# EAGLE schematic MainPSU (EAGLE 7.6.0)
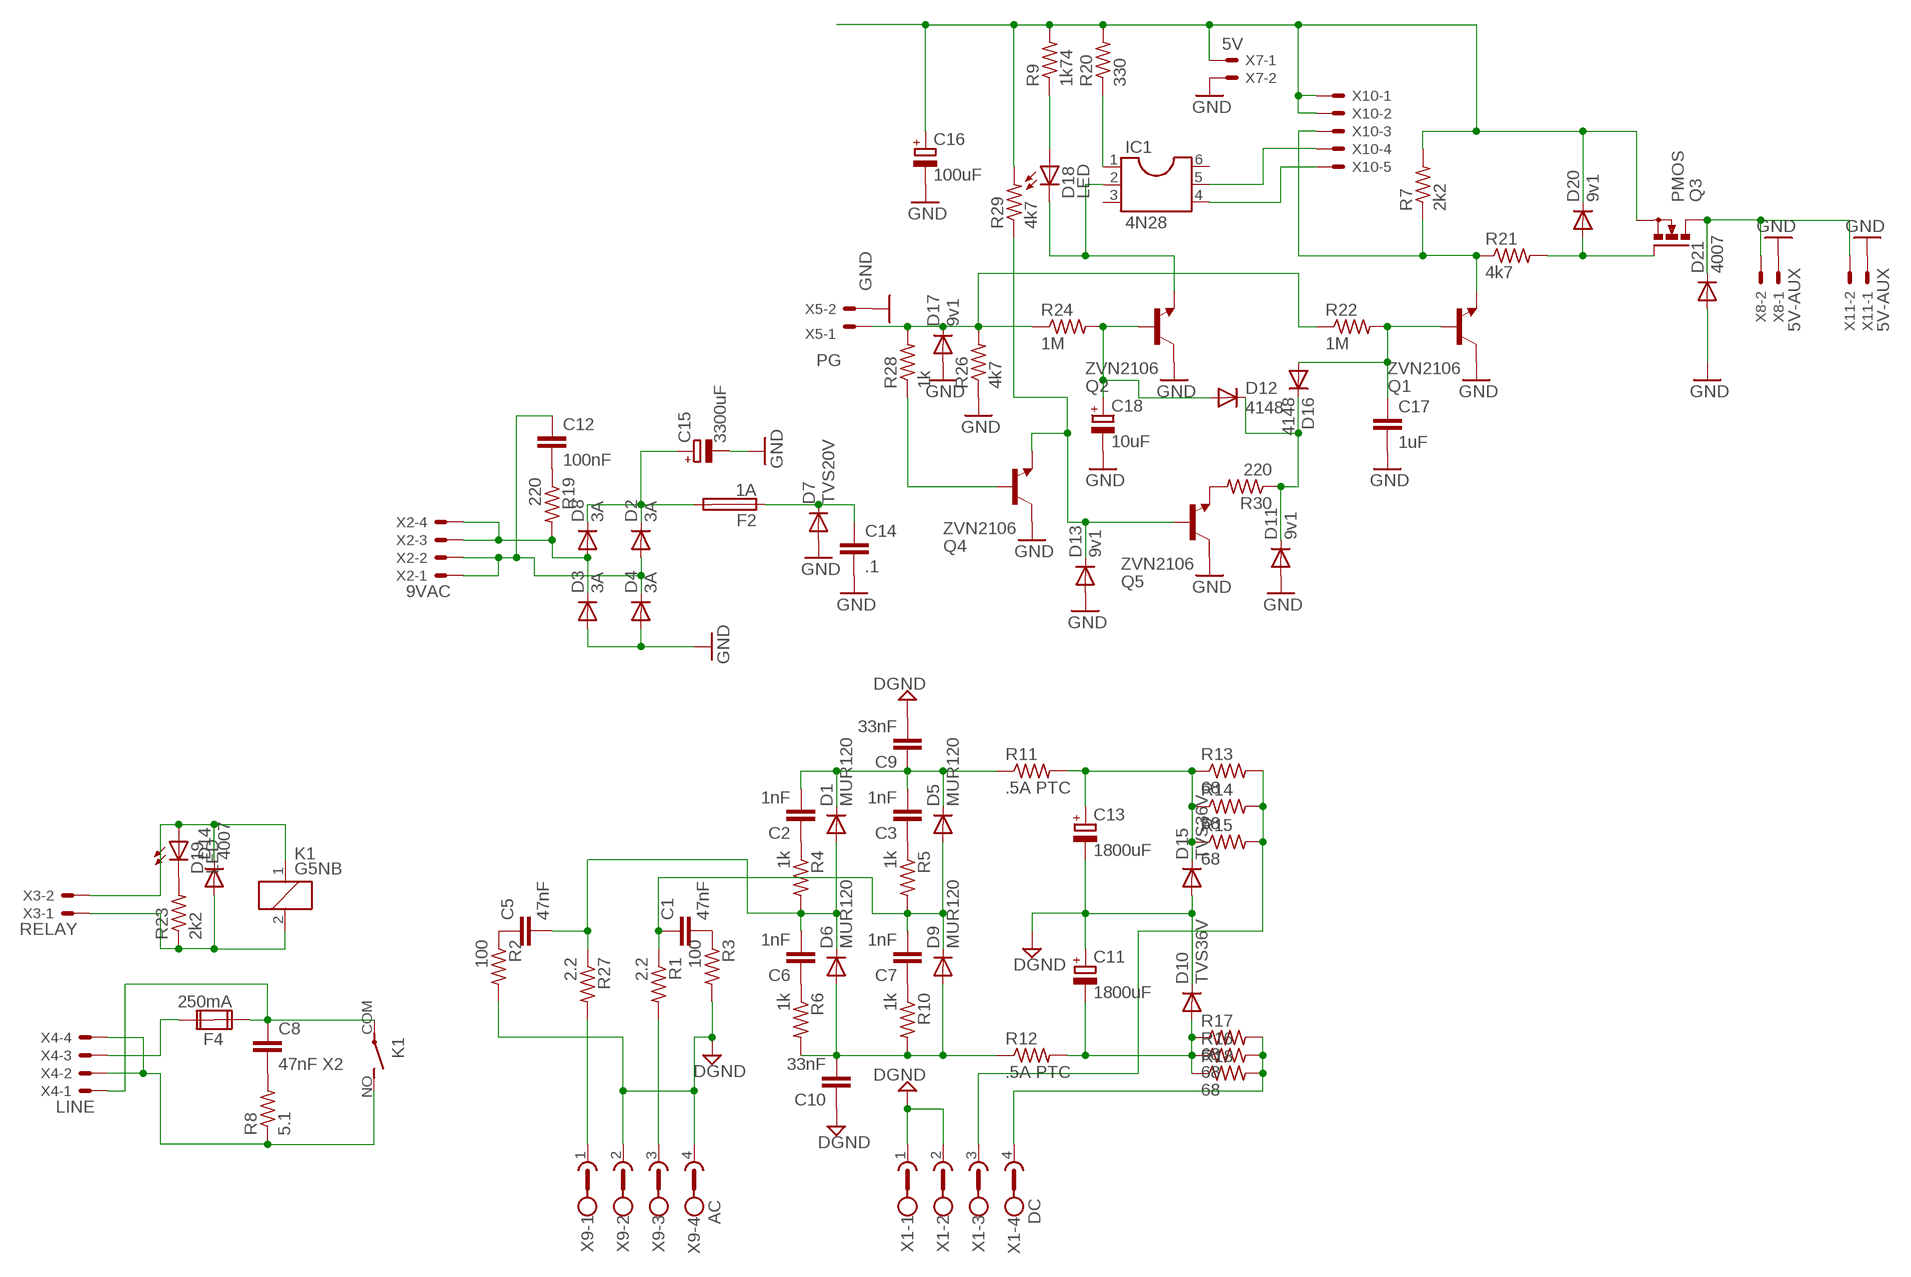
[diagram p0: schematic, sheet 1]

## Parts
C1  47nF  C-EU050-075X075  [C050-075X075]
C2  1nF  C-EU075-042X103  [C075-042X103]
C3  1nF  C-EU075-042X103  [C075-042X103]
C5  47nF  C-EU050-075X075  [C050-075X075]
C6  1nF  C-EU075-042X103  [C075-042X103]
C7  1nF  C-EU075-042X103  [C075-042X103]
C8  47nF X2  C-EU225-062X268  [C225-062X268]
C9  33nF  C-EU050-075X075  [C050-075X075]
C10  33nF  C-EU050-075X075  [C050-075X075]
C11  1800uF  CPOL-EUE7.5-16  [E7,5-16]
C12  100nF  C-EU050-075X075  [C050-075X075]
C13  1800uF  CPOL-EUE7.5-16  [E7,5-16]
C14  .1  C-EUC1812  [C1812]
C15  3300uF  CPOL-EUE7.5-16  [E7,5-16]
C16  100uF  CPOL-EUE3.5-10  [E3,5-10]
C17  1uF  C-EUC1812  [C1812]
C18  10uF  CPOL-EUE2,5-6E  [E2,5-6E]
D1  MUR120  1N4004  [DO41-10]
D2  3A  BYW29  [DO220S]
D3  3A  BYW29  [DO220S]
D4  3A  BYW29  [DO220S]
D5  MUR120  1N4004  [DO41-10]
D6  MUR120  1N4004  [DO41-10]
D7  TVS20V  BY448  [SOD57-10]
D8  3A  1N4004  [DO41-10]
D9  MUR120  1N4004  [DO41-10]
D10  TVS36V  BY448  [SOD57-10]
D11  9v1  1N4148DO35-7  [DO35-7]
D12  4148  1N4148DO35-7  [DO35-7]
D13  9v1  1N4148DO35-7  [DO35-7]
D14  4007  1N4148DO35-10  [DO35-10]
D15  TVS36V  BY448  [SOD57-10]
D16  4148  1N4148DO35-7  [DO35-7]
D17  9v1  1N4148DO35-7  [DO35-7]
D18  LED  SFH482  [SFH482]
D19  LED  SFH482  [SFH482]
D20  9v1  1N4148DO35-10  [DO35-10]
D21  4007  1N4004  [DO41-10]
F2  1A  19560  [19560]
F4  250mA  FUSE2P  [FUSE1]
IC1  4N28  DIL6  [DIL06]
K1  G5NB  LD14H  [LD]
Q1  ZVN2106  BC550B  [TO92-EBC]
Q2  ZVN2106  BC550B  [TO92-EBC]
Q3  PMOS  BUZ11BV  [TO220BV]
Q4  ZVN2106  BC550B  [TO92-EBC]
Q5  ZVN2106  BC550B  [TO92-EBC]
R1  2.2  R-US_0617/5V  [0617V]
R2  100  R-US_0309/12  [0309/12]
R3  100  R-US_0207/5V  [0207/5V]
R4  1k  R-US_0207/7  [0207/7]
R5  1k  R-US_0207/7  [0207/7]
R6  1k  R-US_0309/10  [0309/10]
R7  2k2  R-US_0309/10  [0309/10]
R8  5.1  R-US_0309/10  [0309/10]
R9  1k74  R-US_0309/10  [0309/10]
R10  1k  R-US_0207/7  [0207/7]
R11  .5A PTC  R-US_0207/7  [0207/7]
R12  .5A PTC  R-US_0207/7  [0207/7]
R13  68  R-US_0411/15  [0411/15]
R14  68  R-US_0411/15  [0411/15]
R15  68  R-US_0411/15  [0411/15]
R16  68  R-US_0411/15  [0411/15]
R17  68  R-US_0411/15  [0411/15]
R18  68  R-US_0411/15  [0411/15]
R19  220  R-US_0207/15  [0207/15]
R20  330  R-US_0309/10  [0309/10]
R21  4k7  R-US_0309/10  [0309/10]
R22  1M  R-US_0309/10  [0309/10]
R23  2k2  R-US_0309/10  [0309/10]
R24  1M  R-US_0309/10  [0309/10]
R26  4k7  R-US_0309/10  [0309/10]
R27  2.2  R-US_0617/5V  [0617V]
R28  1k  R-US_0309/10  [0309/10]
R29  4k7  R-US_0309/10  [0309/10]
R30  220  R-US_0309/10  [0309/10]
X1  DC  GMSTBA4  [GMSTBA4]
X2  9VAC  5566-4  [5566-4]
X3  RELAY  22-23-2021  [22-23-2021]
X4  LINE  5566-4  [5566-4]
X5  PG  22-23-2021  [22-23-2021]
X7  5V  22-23-2021  [22-23-2021]
X8  5V-AUX  22-23-2021  [22-23-2021]
X9  AC  GMSTBA4  [GMSTBA4]
X10  22-23-2051  [22-23-2051]
X11  5V-AUX  22-23-2021  [22-23-2021]

## Nets
DGND: C9.2 C10.1 C11.+ C13.- D10.C D15.A R2.2 R3.2 X1.1 X1.2 X9.2 X9.4
GND: C14.2 C15.- C16.- C17.2 C18.- D3.A D4.A D7.A D11.A D13.A D17.A D21.A Q1.C Q2.C Q4.C Q5.C R26.1 X5.2 X7.2 X8.1 X11.1
N$2: R13.2 R14.2 R15.2 X1.3
N$3: R16.2 R17.2 R18.2 X1.4
N$5: R1.2 X9.3
N$6: R27.2 X9.1
N$8: C8.2 R8.2
N$9: C5.1 R2.1
N$11: C1.2 R3.1
N$12: C13.+ D15.C R11.2 R13.1 R14.1 R15.1
N$13: C8.1 F4.1A K1.COM(2:P) X4.1
N$14: C12.2 R19.1
N$15: D21.C Q3.D X8.2 X11.2
N$16: C1.1 C7.2 D5.A D9.C R1.1 R5.2
N$17: F4.2A X4.3
N$18: C2.1 R4.1
N$19: C2.2 C3.2 C9.1 D1.C D5.C R11.1
N$20: C5.2 C6.2 D1.A D6.C R4.2 R27.1
N$21: K1.NO(2:S) R8.1 X4.2 X4.4
N$22: C3.1 R5.1
N$24: C11.- D10.A R12.2 R16.1 R17.1 R18.1
N$26: C6.1 R6.1
N$28: D3.C D8.A R19.2 X2.3 X2.4
N$29: C10.2 D6.A D9.A R6.2 R10.2 R12.1
N$30: C7.1 R10.1
N$33: C16.+ D20.C Q3.S R7.2 R9.2 R20.2 R29.2 X7.1 X10.1 X10.2
N$34: D18.K(C) IC1.2 Q2.E
N$35: C12.1 D2.A D4.C X2.1 X2.2
N$36: D14.A K1.2 R23.1 X3.1
N$37: D20.A Q3.G R21.2
N$38: C18.+ D12.A Q2.B R24.2
N$39: C17.1 D16.A Q1.B R22.2
N$40: D17.C R22.1 R24.1 R26.2 R28.2 X5.1
N$41: Q4.B R28.1
N$42: D13.C Q4.E Q5.B R29.1
N$43: Q5.E R30.2
N$44: D11.C D12.C D16.C R30.1
N$45: D19.K(C) R23.2
N$46: IC1.1 R20.1
N$48: C15.+ D2.C D8.C F2.2
N$49: C14.1 D7.C F2.1
N$51: D14.C D19.A K1.1 X3.2
N$52: IC1.4 X10.5
N$53: Q1.E R7.1 R21.1 X10.3
N$54: D18.A R9.1
N$55: IC1.5 X10.4
Unconnected: F4.1B F4.2B IC1.3 IC1.6

## Library data of the parts
C1-C3 C5-C10 C12 C14 C17 = resistor:C-EU: CAPACITOR, European symbol
C11 C13 C15 C16 C18 = resistor:CPOL-EU: POLARIZED CAPACITOR, European symbol
D1 D5 D6 D8 D9 D21 = diode:1N4004: DIODE general purpose rectifier, 1 A
D2-D4 = diode:BYW29: DIODE ultra fast rectifier, 200 V, 8 A
D7 D10 D15 = diode:BY448: DIODE damper diode
D11-D14 D16 D17 D20 = diode:1N4148: DIODE high speed (Philips)
D18 D19 = led:SFH482: IR LED infrared emitting diode, Infineon
F2 = fuse:19560: FUSE HOLDER TR5, Wickmann; MPN: 56000001009; OC_FARNELL: 1185363; OC_NEWARK: 15P8392
F4 = special:FUSE2P: FUSE 5 x 20 mm
IC1 = ic-package:DIL6: Dual In Line / Socket
K1 = relay:LD?*: Slim Power Relay NAiS Source: http://www.mew-europe.com/.. en_ds_61112_0000.pdf; OC_FARNELL: unknown; OC_NEWARK: unknown
Q1 Q2 Q4 Q5 = transistor-npn:BC550*: NPN Transistor
Q3 = transistor-power:BUZ11: N-CHANNEL MOS FET
R1-R24 R26-R30 = resistor:R-US_: RESISTOR, American symbol
X1 X9 = con-phoenix-762:GMSTBA4: PHOENIX; MF: FARNELL; MPN: 1757268; OC_FARNELL: 3705195; OC_NEWARK: 71C4163
X2 X4 = con-molex:5566-4: Mini FIT connector 4 pol Source: http://www.molex.com; OC_FARNELL: unknown; OC_NEWARK: unknown
X3 X5 X7 X8 X11 = con-molex:22-23-2021: .100" (2.54mm) Center Header - 2 Pin; MF: MOLEX; MPN: 22-23-2021; OC_FARNELL: 1462926; OC_NEWARK: 25C3832
X10 = con-molex:22-23-2051: .100" (2.54mm) Center Header - 5 Pin; MF: MOLEX; MPN: 22-23-2051; OC_FARNELL: 1462952; OC_NEWARK: 38C9178